# EAGLE schematic EEZ Arduino shield r1B12b (EAGLE 6.1)
Assembly variants: Farnell, TME

## Sheet 1 of 3
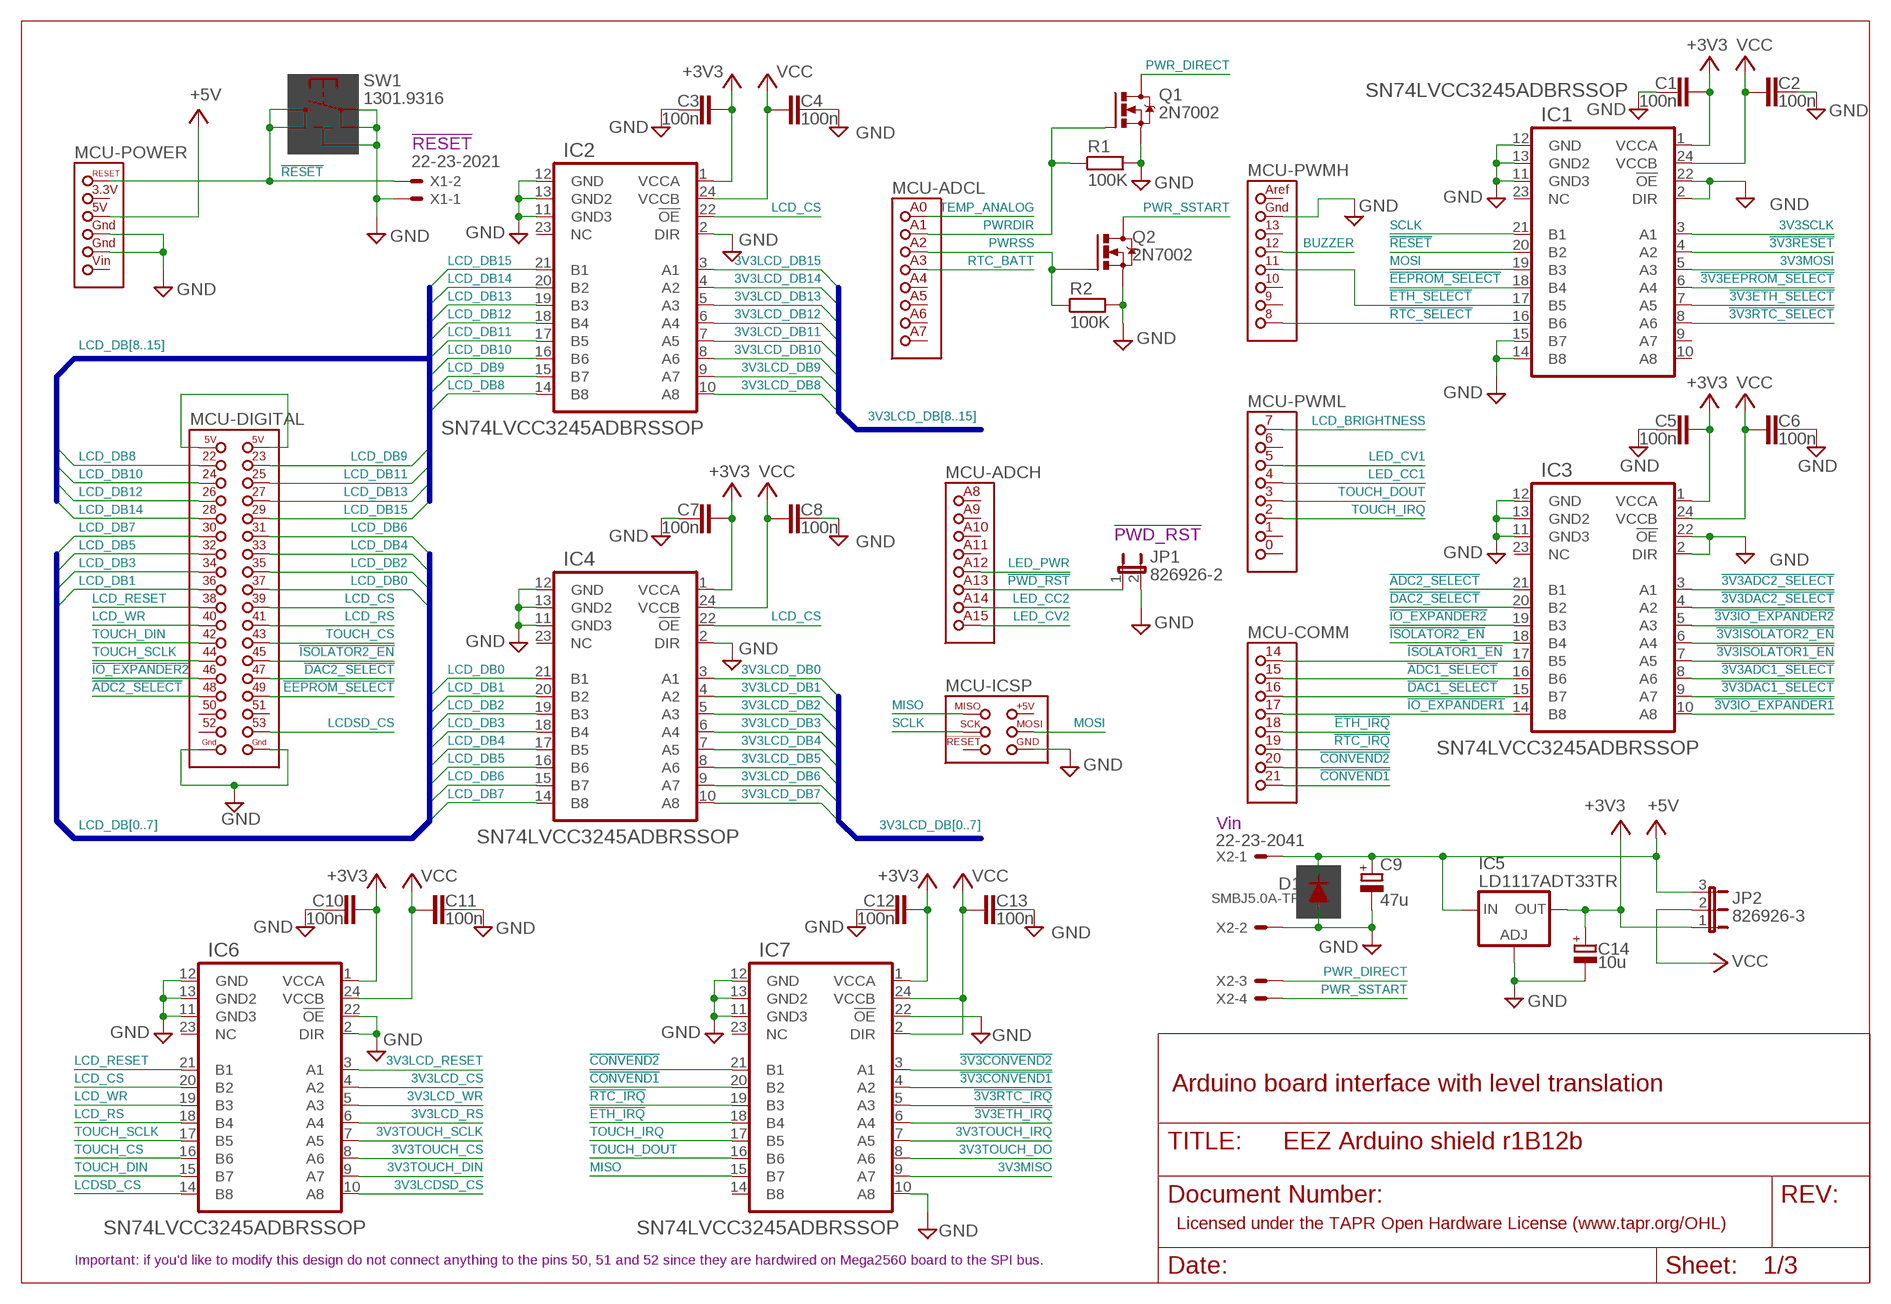
[diagram p0: schematic, sheet 1]

### Parts
C1  100n  C-EUC0603  [C0603]
C2  100n  C-EUC0603  [C0603]
C3  100n  C-EUC0603  [C0603]
C4  100n  C-EUC0603  [C0603]
C5  100n  C-EUC0603  [C0603]
C6  100n  C-EUC0603  [C0603]
C7  100n  C-EUC0603  [C0603]
C8  100n  C-EUC0603  [C0603]
C9  47u  ECAPPANASONIC_C  [PANASONIC_C]
C10  100n  C-EUC0603  [C0603]
C11  100n  C-EUC0603  [C0603]
C12  100n  C-EUC0603  [C0603]
C13  100n  C-EUC0603  [C0603]
C14  10u  ECAPPANASONIC_C  [PANASONIC_C]
D1  SMBJ5.0A-TR  DIODEDO214AA  [DO214AA]
IC1  SN74LVCC3245ADBRSSOP  [SOP65P780X200-24N]
IC2  SN74LVCC3245ADBRSSOP  [SOP65P780X200-24N]
IC3  SN74LVCC3245ADBRSSOP  [SOP65P780X200-24N]
IC4  SN74LVCC3245ADBRSSOP  [SOP65P780X200-24N]
IC5  LD1117ADT33TR  LD117ADT33TR  [DPACK]
IC6  SN74LVCC3245ADBRSSOP  [SOP65P780X200-24N]
IC7  SN74LVCC3245ADBRSSOP  [SOP65P780X200-24N]
JP1  826926-2  JP1E  [JP1]
JP2  826926-3  JUMPER_3-PIN  [JUMPER_3-PIN]
MCU  ARDUINO_MEGA+ICSPMIRROR  [ARDUINO+ICSP_MIRROR]
Q1  2N7002  [SOT103P240X110-3N]
Q2  2N7002  [SOT103P240X110-3N]
R1  100K  R-EU_R0805  [R0805]
R2  100K  R-EU_R0805  [R0805]
SW1  1301.9316  TACT_SW  [TACTM-6XN]
X1  22-23-2021  [22-23-2021]
X2  22-23-2041  [22-23-2041]

### Nets
3V3LCD_CS: IC6.4(A2) ; also sheet 3
3V3LCD_DB0: IC4.3(A1) ; also sheet 3
3V3LCD_DB1: IC4.4(A2) ; also sheet 3
3V3LCD_DB2: IC4.5(A3) ; also sheet 3
3V3LCD_DB3: IC4.6(A4) ; also sheet 3
3V3LCD_DB4: IC4.7(A5) ; also sheet 3
3V3LCD_DB5: IC4.8(A6) ; also sheet 3
3V3LCD_DB6: IC4.9(A7) ; also sheet 3
3V3LCD_DB7: IC4.10(A8) ; also sheet 3
3V3LCD_DB8: IC2.10(A8) ; also sheet 3
3V3LCD_DB9: IC2.9(A7) ; also sheet 3
3V3LCD_DB10: IC2.8(A6) ; also sheet 3
3V3LCD_DB11: IC2.7(A5) ; also sheet 3
3V3LCD_DB12: IC2.6(A4) ; also sheet 3
3V3LCD_DB13: IC2.5(A3) ; also sheet 3
3V3LCD_DB14: IC2.4(A2) ; also sheet 3
3V3LCD_DB15: IC2.3(A1) ; also sheet 3
3V3LCD_RESET: IC6.3(A1) ; also sheet 3
3V3LCD_RS: IC6.6(A4) ; also sheet 3
3V3LCD_WR: IC6.5(A3) ; also sheet 3
3V3LCDSD_CS: IC6.10(A8) ; also sheet 3
3V3MISO: IC7.9(A7) ; also sheet 2,3
3V3MOSI: IC1.5(A3) ; also sheet 2,3
3V3SCLK: IC1.3(A1) ; also sheet 2,3
3V3TOUCH_CS: IC6.8(A6) ; also sheet 3
3V3TOUCH_DIN: IC6.9(A7) ; also sheet 3
3V3TOUCH_DO: IC7.8(A6) ; also sheet 3
3V3TOUCH_IRQ: IC7.7(A5) ; also sheet 3
3V3TOUCH_SCLK: IC6.7(A5) ; also sheet 3
!3V3ADC1_SELECT: IC3.8(A6) ; also sheet 2
!3V3ADC2_SELECT: IC3.3(A1) ; also sheet 2
!3V3CONVEND1: IC7.4(A2) ; also sheet 2
!3V3CONVEND2: IC7.3(A1) ; also sheet 2
!3V3DAC1_SELECT: IC3.9(A7) ; also sheet 2
!3V3DAC2_SELECT: IC3.4(A2) ; also sheet 2
!3V3EEPROM_SELECT: IC1.6(A4) ; also sheet 3
!3V3ETH_IRQ: IC7.6(A4) ; also sheet 3
!3V3ETH_SELECT: IC1.7(A5) ; also sheet 3
!3V3IO_EXPANDER1: IC3.10(A8) ; also sheet 2
!3V3IO_EXPANDER2: IC3.5(A3) ; also sheet 2
!3V3ISOLATOR1_EN: IC3.7(A5) ; also sheet 2
!3V3ISOLATOR2_EN: IC3.6(A4) ; also sheet 2
!3V3RESET: IC1.4(A2) ; also sheet 2,3
!3V3RTC_IRQ: IC7.5(A3) ; also sheet 3
!3V3RTC_SELECT: IC1.8(A6) ; also sheet 3
!ADC1_SELECT: IC3.16(B6) MCU.15
!ADC2_SELECT: IC3.21(B1) MCU.48(-DIGITAL:48(PL3))
!CONVEND1: IC7.20(B2) MCU.21
!CONVEND2: IC7.21(B1) MCU.20
!DAC1_SELECT: IC3.15(B7) MCU.16
!DAC2_SELECT: IC3.20(B2) MCU.47(-DIGITAL:47(PL4))
!EEPROM_SELECT: IC1.18(B4) MCU.49(-DIGITAL:49(PL2))
!ETH_IRQ: IC7.18(B4) MCU.18
!ETH_SELECT: IC1.17(B5) MCU.11
!IO_EXPANDER1: IC3.14(B8) MCU.17
!IO_EXPANDER2: IC3.19(B3) MCU.46(-DIGITAL:46(PL5))
!ISOLATOR1_EN: IC3.17(B5) MCU.14
!ISOLATOR2_EN: IC3.18(B4) MCU.45(-DIGITAL:45(PL6))
!PWD_RST: JP1.1 MCU.A13(-ADCH:ADC13)
!RESET: IC1.20(B2) MCU.RESET(-POWER:!RESET) SW1.3 SW1.4 X1.2
!RTC_IRQ: IC7.19(B3) MCU.19
!RTC_SELECT: IC1.16(B6) MCU.8(-PWMH:8(PH5))
+3V3 [power]: C1.1 C3.1 C5.1 C7.1 C10.1 C12.1 C14.1(+) IC1.1(VCCA) IC2.1(VCCA) IC3.1(VCCA) IC4.1(VCCA) IC5.4(OUT) IC6.1(VCCA) IC7.1(VCCA) JP2.1 ; also sheet 2,3
+5V: C9.1(+) D1.C IC5.3(IN) JP2.3 MCU.5V(-POWER:5V) X2.1 ; also sheet 2,3
BUZZER: MCU.12 ; also sheet 3
GND [gnd]: C1.2 C2.1 C3.2 C4.1 C5.2 C6.1 C7.2 C8.1 C9.2(-) C10.2 C11.1 C12.2 C13.1 C14.2(-) D1.A IC1.2(DIR) IC1.11(GND3) IC1.12(GND) IC1.13(GND2) IC1.14(B8) IC1.15(B7) IC1.22(!OE) IC2.2(DIR) IC2.11(GND3) IC2.12(GND) IC2.13(GND2) IC3.2(DIR) IC3.11(GND3) IC3.12(GND) IC3.13(GND2) IC3.22(!OE) IC4.2(DIR) IC4.11(GND3) IC4.12(GND) IC4.13(GND2) IC5.1(ADJ) IC6.2(DIR) IC6.11(GND3) IC6.12(GND) IC6.13(GND2) IC6.22(!OE) IC7.10(A8) IC7.11(GND3) IC7.12(GND) IC7.13(GND2) IC7.22(!OE) JP1.2 MCU.GND1(-POWER:GND1) MCU.GND2(-POWER:GND2) MCU.GND3(-DIGITAL:GND3) MCU.GND4(-DIGITAL:GND4) MCU.GND(-PWMH:GND) MCU.ICSP_GND(-ICSP:GND) Q1.2(S) Q2.2(S) R1.2 R2.2 SW1.1 SW1.2 SW1.5(5-GND) X1.1 X2.2 ; also sheet 2,3
LCD_BRIGHTNESS: MCU.7(-PWML:7(PH4)) ; also sheet 3
LCD_CS: IC2.22(!OE) IC4.22(!OE) IC6.20(B2) MCU.39(-DIGITAL:39(PC0))
LCD_DB0: IC4.21(B1) MCU.37(-DIGITAL:37(PC2))
LCD_DB1: IC4.20(B2) MCU.36(-DIGITAL:36(PC3))
LCD_DB2: IC4.19(B3) MCU.35(-DIGITAL:35(PC4))
LCD_DB3: IC4.18(B4) MCU.34(-DIGITAL:34(PC5))
LCD_DB4: IC4.17(B5) MCU.33(-DIGITAL:33(PC6))
LCD_DB5: IC4.16(B6) MCU.32(-DIGITAL:32(PC7))
LCD_DB6: IC4.15(B7) MCU.31(-DIGITAL:31(PA7))
LCD_DB7: IC4.14(B8) MCU.30(-DIGITAL:30(PA6))
LCD_DB8: IC2.14(B8) MCU.22
LCD_DB9: IC2.15(B7) MCU.23
LCD_DB10: IC2.16(B6) MCU.24(-DIGITAL:24(PA0))
LCD_DB11: IC2.17(B5) MCU.25(-DIGITAL:25(PA1))
LCD_DB12: IC2.18(B4) MCU.26(-DIGITAL:26(PA2))
LCD_DB13: IC2.19(B3) MCU.27(-DIGITAL:27(PA3))
LCD_DB14: IC2.20(B2) MCU.28(-DIGITAL:28(PA4))
LCD_DB15: IC2.21(B1) MCU.29(-DIGITAL:29(PA5))
LCD_RESET: IC6.21(B1) MCU.38(-DIGITAL:38(PC1))
LCD_RS: IC6.18(B4) MCU.41(-DIGITAL:41(PG2))
LCD_WR: IC6.19(B3) MCU.40(-DIGITAL:40(PD7))
LCDSD_CS: IC6.14(B8) MCU.53(-DIGITAL:53(PB2/MOSI))
LED_CC1: MCU.4(-PWML:4(PG5)) ; also sheet 2
LED_CC2: MCU.A14(-ADCH:ADC14) ; also sheet 2
LED_CV1: MCU.5(-PWML:5(PE3)) ; also sheet 2
LED_CV2: MCU.A15(-ADCH:ADC15) ; also sheet 2
LED_PWR: MCU.A12(-ADCH:ADC12) ; also sheet 2
MISO: IC7.15(B7) MCU.ICSP_MISO(-ICSP:MISO)
MOSI: IC1.19(B3) MCU.ICSP_MOSI(-ICSP:MOSI)
N$20: MCU.5V(1)(-DIGITAL:5V(1)) MCU.5V(2)(-DIGITAL:5V(2))
PWR_DIRECT: Q1.3(D) X2.3
PWR_SSTART: Q2.3(D) X2.4
PWRDIR: MCU.A1(-ADCL:ADC1) Q1.1(G) R1.1
PWRSS: MCU.A2(-ADCL:ADC2) Q2.1(G) R2.1
RTC_BATT: MCU.A3(-ADCL:ADC3) ; also sheet 3
SCLK: IC1.21(B1) MCU.ICSP_SCK(-ICSP:SCK)
TEMP_ANALOG: MCU.A0(-ADCL:ADC0) ; also sheet 3
TOUCH_CS: IC6.16(B6) MCU.43(-DIGITAL:43(PG0))
TOUCH_DIN: IC6.15(B7) MCU.42(-DIGITAL:42(PG1))
TOUCH_DOUT: IC7.16(B6) MCU.3(-PWML:3(PE5))
TOUCH_IRQ: IC7.17(B5) MCU.2(-PWML:2(PE4))
TOUCH_SCLK: IC6.17(B5) MCU.44(-DIGITAL:44(PL7))
VCC [power]: C2.2 C4.2 C6.2 C8.2 C11.2 C13.2 IC1.24(VCCB) IC2.24(VCCB) IC3.24(VCCB) IC4.24(VCCB) IC6.24(VCCB) IC7.2(DIR) IC7.24(VCCB) JP2.2 ; also sheet 3
Unconnected: IC1.9(A7) IC1.10(A8) IC1.23(NC) IC2.23(NC) IC3.23(NC) IC4.23(NC) IC6.23(NC) IC7.14(B8) IC7.23(NC) MCU.0(-PWML:0(PE0)) MCU.1(-PWML:1(PE1)) MCU.3.3V(-POWER:3V3) MCU.6(-PWML:6(PH3)) MCU.9(-PWMH:9(PH6)) MCU.10 MCU.13 MCU.50(-DIGITAL:50(PL1/MISO)) MCU.51(-DIGITAL:51(PL0)) MCU.52(-DIGITAL:52(PB3/SCK)) MCU.A4(-ADCL:ADC4) MCU.A5(-ADCL:ADC5) MCU.A6(-ADCL:ADC6) MCU.A7(-ADCL:ADC7) MCU.A8(-ADCH:ADC8) MCU.A9(-ADCH:ADC9) MCU.A10(-ADCH:ADC10) MCU.A11(-ADCH:ADC11) MCU.AREF(-PWMH:AREF) MCU.ICSP_+5V(-ICSP:+5V) MCU.ICSP_RESET(-ICSP:!RESET) MCU.VIN(-POWER:VIN)

### Buses
LCD_DB[8..15]
LCD_DB[0..7]
3V3LCD_DB[8..15]
3V3LCD_DB[0..7]

### Notes on the sheet
- !RESET
- !PWD_RST
- Vin
- Arduino board interface with level translation
- Licensed under the TAPR Open Hardware License (www.tapr.org/OHL)
- Important: if you'd like to modify this design do not connect anything to the pins 50, 51 and 52 since they are hardwired on Mega2560 board to the SPI bus.

## Sheet 2 of 3
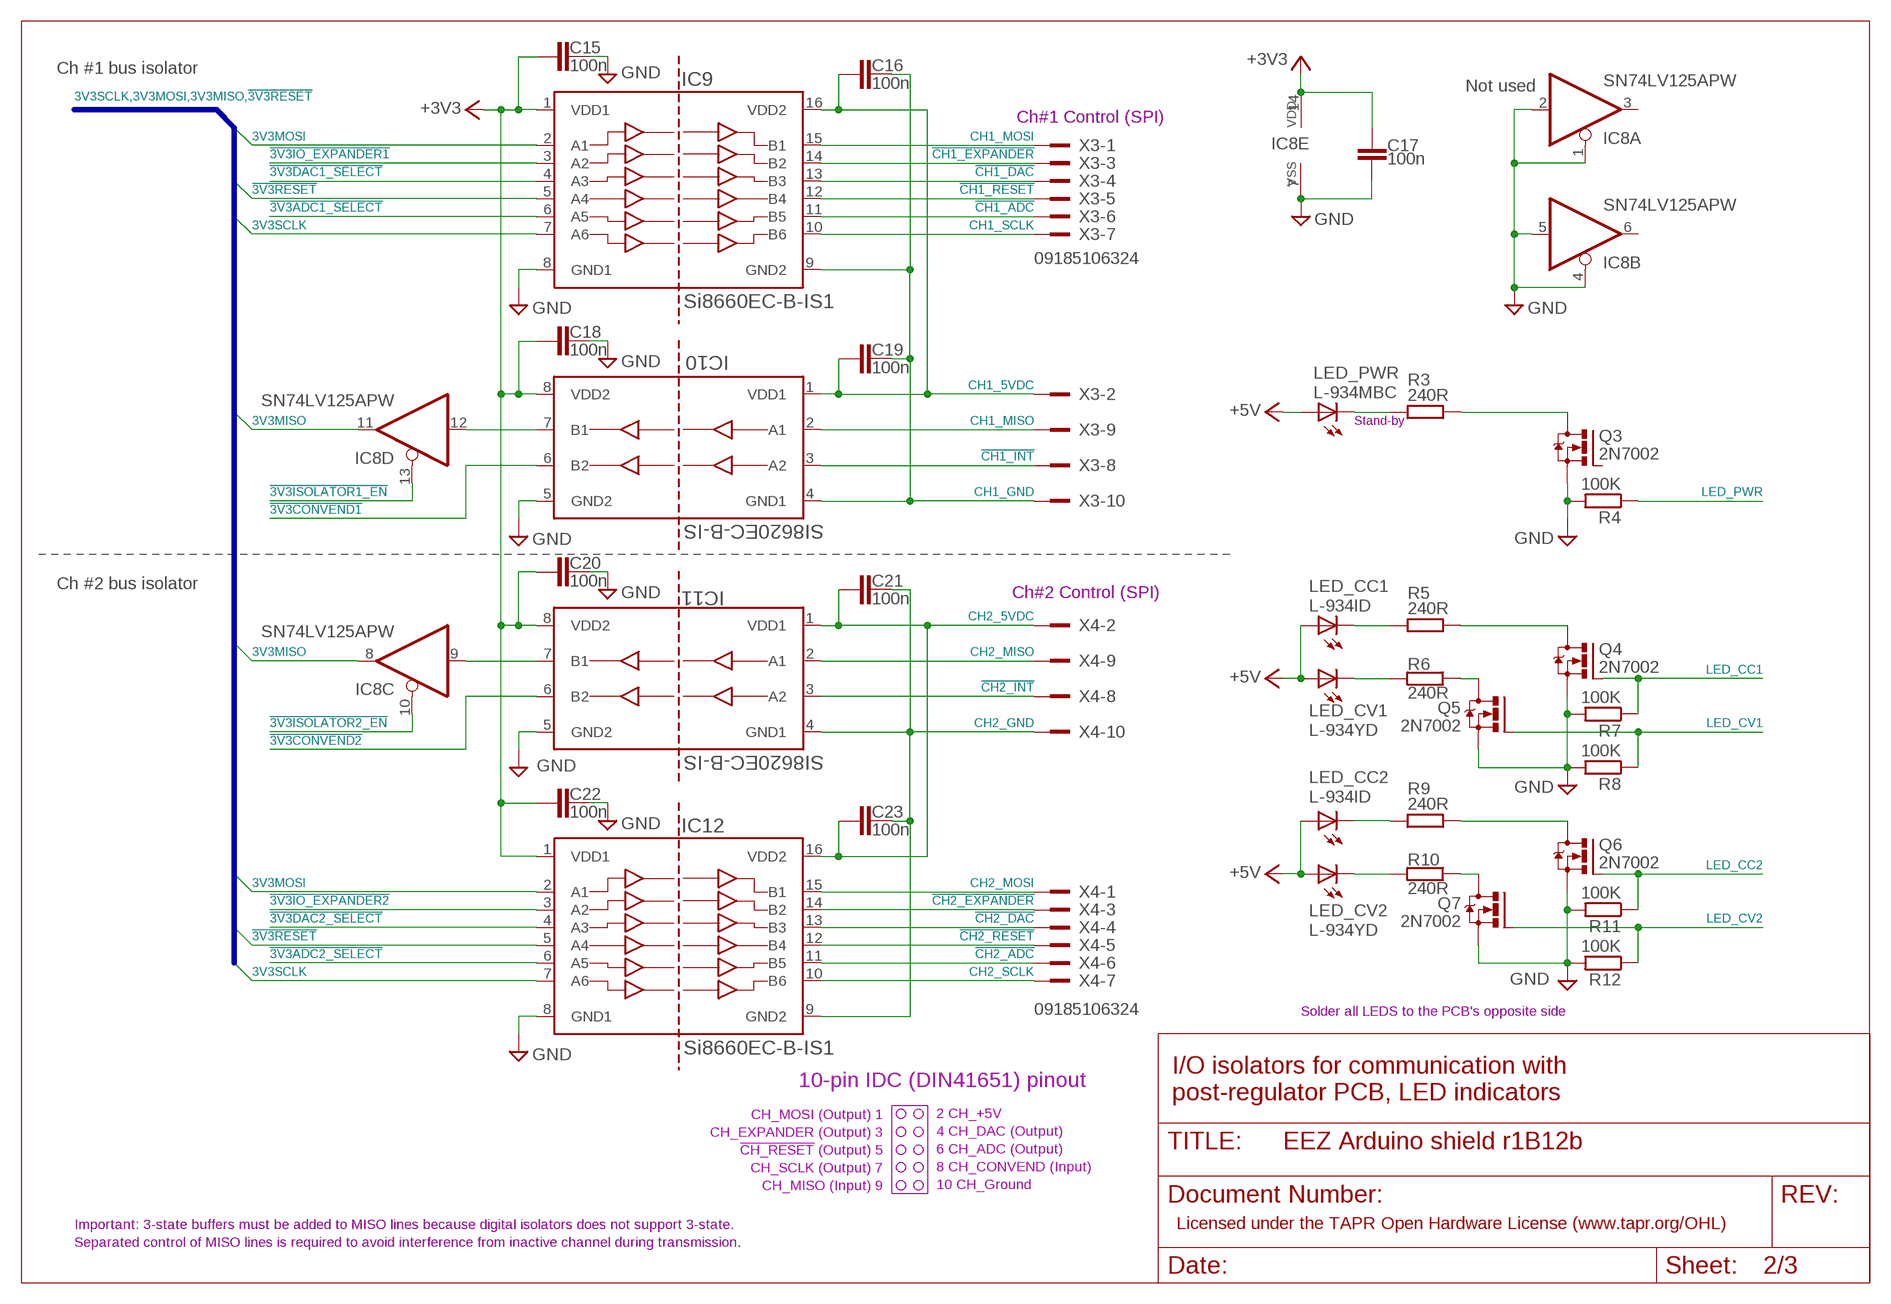
[diagram p1: schematic, sheet 2]

### Parts
C15  100n  C-EUC0603  [C0603]
C16  100n  C-EUC0603  [C0603]
C17  100n  C-EUC0603  [C0603]
C18  100n  C-EUC0603  [C0603]
C19  100n  C-EUC0603  [C0603]
C20  100n  C-EUC0603  [C0603]
C21  100n  C-EUC0603  [C0603]
C22  100n  C-EUC0603  [C0603]
C23  100n  C-EUC0603  [C0603]
IC8  SN74LV125APW  SN74LV125ATSSOP14  [SOP65P640X120-14N]
IC9  Si8660EC-B-IS1  SI8660  [SOIC-16]
IC10  SI8620EC-B-IS  SI8620  [SOIC127P600X173-8N]
IC11  SI8620EC-B-IS  SI8620  [SOIC127P600X173-8N]
IC12  Si8660EC-B-IS1  SI8660  [SOIC-16]
LED_CC1  L-934ID  LED3MM  [LED3MM]
LED_CC2  L-934ID  LED3MM  [LED3MM]
LED_CV1  L-934YD  LED3MM  [LED3MM]
LED_CV2  L-934YD  LED3MM  [LED3MM]
LED_PWR  L-934MBC  LED3MM  [LED3MM]
Q3  2N7002  [SOT103P240X110-3N]
Q4  2N7002  [SOT103P240X110-3N]
Q5  2N7002  [SOT103P240X110-3N]
Q6  2N7002  [SOT103P240X110-3N]
Q7  2N7002  [SOT103P240X110-3N]
R3  240R  R-EU_R0805  [R0805]
R4  100K  R-EU_R0805  [R0805]
R5  240R  R-EU_R0805  [R0805]
R6  240R  R-EU_R0805  [R0805]
R7  100K  R-EU_R0805  [R0805]
R8  100K  R-EU_R0805  [R0805]
R9  240R  R-EU_R0805  [R0805]
R10  240R  R-EU_R0805  [R0805]
R11  100K  R-EU_R0805  [R0805]
R12  100K  R-EU_R0805  [R0805]
X3  09185106324  IDC-10PINGREY  [IDC-10PIN]
X4  09185106324  IDC-10PINGREY  [IDC-10PIN]

### Nets
3V3MISO: IC8.8(C:O) IC8.11(D:O) ; also sheet 1,3
3V3MOSI: IC9.2(A1) IC12.2(A1) ; also sheet 1,3
3V3SCLK: IC9.7(A6) IC12.7(A6) ; also sheet 1,3
!3V3ADC1_SELECT: IC9.6(A5) ; also sheet 1
!3V3ADC2_SELECT: IC12.6(A5) ; also sheet 1
!3V3CONVEND1: IC10.6(B2) ; also sheet 1
!3V3CONVEND2: IC11.6(B2) ; also sheet 1
!3V3DAC1_SELECT: IC9.4(A3) ; also sheet 1
!3V3DAC2_SELECT: IC12.4(A3) ; also sheet 1
!3V3IO_EXPANDER1: IC9.3(A2) ; also sheet 1
!3V3IO_EXPANDER2: IC12.3(A2) ; also sheet 1
!3V3ISOLATOR1_EN: IC8.13(D:OE) ; also sheet 1
!3V3ISOLATOR2_EN: IC8.10(C:OE) ; also sheet 1
!3V3RESET: IC9.5(A4) IC12.5(A4) ; also sheet 1,3
!CH1_ADC: IC9.11(B5) X3.6
!CH1_DAC: IC9.13(B3) X3.4
!CH1_EXPANDER: IC9.14(B2) X3.3
!CH1_INT: IC10.3(A2) X3.8
!CH1_RESET: IC9.12(B4) X3.5
!CH2_ADC: IC12.11(B5) X4.6
!CH2_DAC: IC12.13(B3) X4.4
!CH2_EXPANDER: IC12.14(B2) X4.3
!CH2_INT: IC11.3(A2) X4.8
!CH2_RESET: IC12.12(B4) X4.5
+3V3 [power]: C15.1 C17.2 C18.1 C20.1 C22.1 IC8.14(E:VDD) IC9.1(VDD1) IC10.8(VDD2) IC11.8(VDD2) IC12.1(VDD1) ; also sheet 1,3
+5V: LED_CC1.A LED_CC2.A LED_CV1.A LED_CV2.A LED_PWR.A ; also sheet 1,3
CH1_5VDC: C16.1 C19.1 IC9.16(VDD2) IC10.1(VDD1) X3.2
CH1_GND [isolators]: C16.2 C19.2 IC9.9(GND2) IC10.4(GND1) X3.10
CH1_MISO: IC10.2(A1) X3.9
CH1_MOSI: IC9.15(B1) X3.1
CH1_SCLK: IC9.10(B6) X3.7
CH2_5VDC: C21.1 C23.1 IC11.1(VDD1) IC12.16(VDD2) X4.2
CH2_GND: C21.2 C23.2 IC11.4(GND1) IC12.9(GND2) X4.10
CH2_MISO: IC11.2(A1) X4.9
CH2_MOSI: IC12.15(B1) X4.1
CH2_SCLK: IC12.10(B6) X4.7
GND [gnd]: C15.2 C17.1 C18.2 C20.2 C22.2 IC8.1(A:OE) IC8.2(A:I) IC8.4(B:OE) IC8.5(B:I) IC8.7(E:VSS) IC9.8(GND1) IC10.5(GND2) IC11.5(GND2) IC12.8(GND1) Q3.2(S) Q4.2(S) Q5.2(S) Q6.2(S) Q7.2(S) R4.2 R7.2 R8.2 R11.2 R12.2 ; also sheet 1,3
LED_CC1: Q4.1(G) R7.1 ; also sheet 1
LED_CC2: Q6.1(G) R11.1 ; also sheet 1
LED_CV1: Q5.1(G) R8.1 ; also sheet 1
LED_CV2: Q7.1(G) R12.1 ; also sheet 1
LED_PWR: R4.1 ; also sheet 1
N$2: Q3.3(D) R3.2
N$4: LED_PWR.K(C) R3.1
N$11: LED_CV1.K(C) R6.2
N$12: Q6.3(D) R9.2
N$14: LED_CV2.K(C) R10.2
N$15: LED_CC2.K(C) R9.1
N$21: Q4.3(D) R5.2
N$23: Q7.3(D) R10.1
N$28: Q5.3(D) R6.1
N$29: LED_CC1.K(C) R5.1
N$151: IC8.12(D:I) IC10.7(B1)
N$164: IC8.9(C:I) IC11.7(B1)
Unconnected: IC8.3(A:O) IC8.6(B:O) Q3.1(G)

### Buses
3V3SCLK,3V3MOSI,3V3MISO,!3V3RESET

### Notes on the sheet
- Ch #1 bus isolator
- Not used
- Ch#1 Control (SPI)
- Stand-by
- Ch #2 bus isolator
- Ch#2 Control (SPI)
- Solder all LEDS to the PCB's opposite side
- I/O isolators for communication with
- 10-pin IDC (DIN41651) pinout
- post-regulator PCB, LED indicators
- CH_MOSI (Output) 1
- 2 CH_+5V
- CH_EXPANDER (Output) 3
- 4 CH_DAC (Output)
- !CH_RESET! (Output) 5
- 6 CH_ADC (Output)
- CH_SCLK (Output) 7
- 8 CH_CONVEND (Input)
- CH_MISO (Input) 9
- 10 CH_Ground
- Important: 3-state buffers must be added to MISO lines because digital isolators does not support 3-state. | Licensed under the TAPR Open Hardware License (www.tapr.org/OHL)
- Separated control of MISO lines is required to avoid interference from inactive channel during transmission.

## Sheet 3 of 3
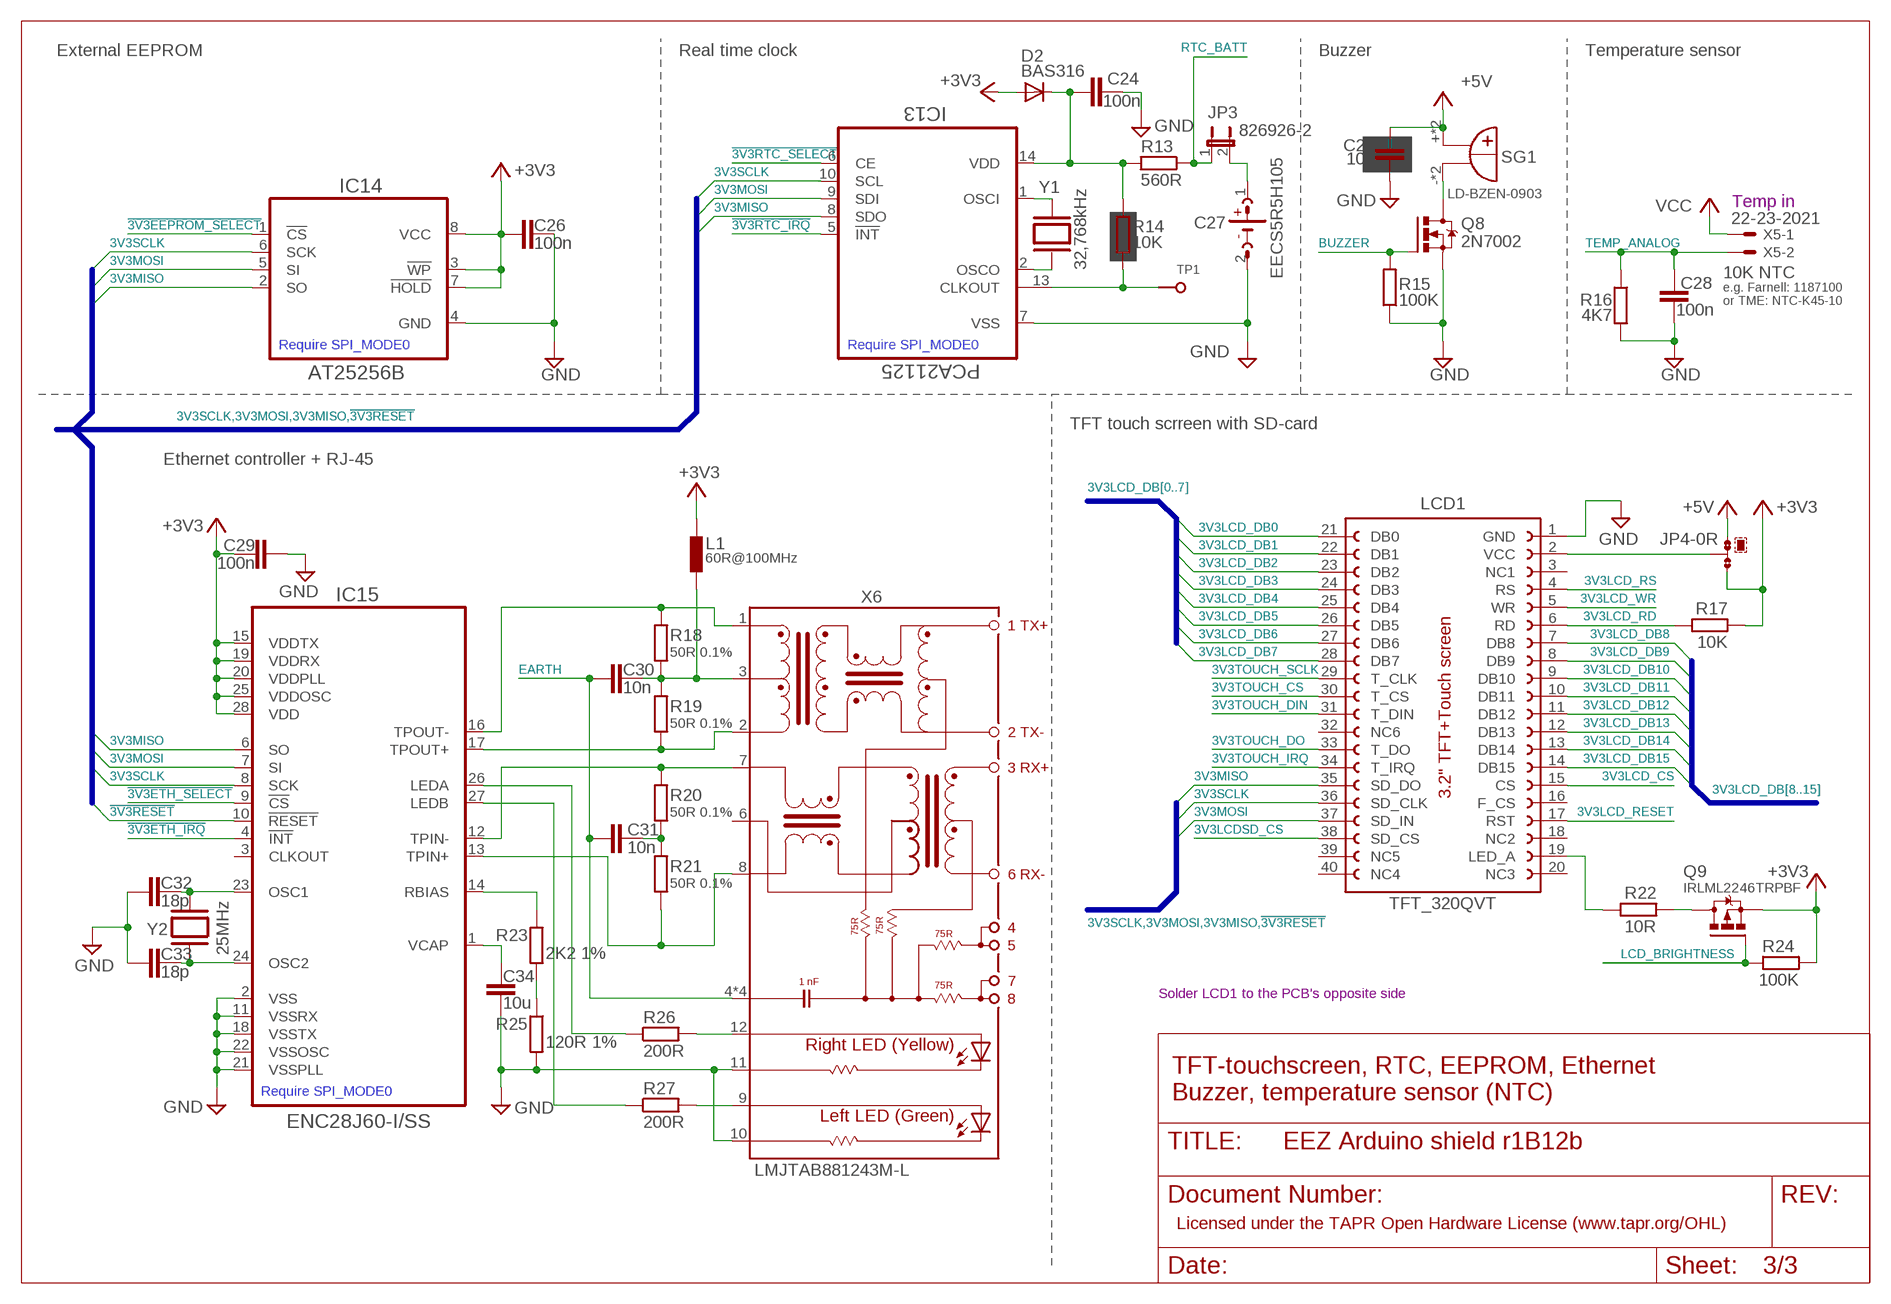
[diagram p2: schematic, sheet 3]

### Parts
C24  100n  C-EUC0603  [C0603]
C25  10u  C-EUC1206  [C1206]
C26  100n  C-EUC0603  [C0603]
C27  EECS5R5H105  SUPER_CAP  [SG-R20MM]
C28  100n  C-EUC0603  [C0603]
C29  100n  C-EUC0603  [C0603]
C30  10n  C-EUC1206  [C1206]
C31  10n  C-EUC1206  [C1206]
C32  18p  C-EUC0805  [C0805]
C33  18p  C-EUC0805  [C0805]
C34  10u  C-EUC1206  [C1206]
D2  BAS316  DIODE-SOD323-W  [SOD323-W]
IC13  PCA21125  PCA21125TSSOP-14  [SOP65P640X120-14N]
IC14  AT25256B  AT25XXXSOIC8  [SOIC127P600X175-8N]
IC15  ENC28J60-I/SS  [SOP65P780X200-28N]
JP3  826926-2  JP1E  [JP1]
JP4  0R-JUMPA  [A0R-JMP]
L1  60R@100MHz  FERRITE_BEAD0603  [BEAD0603]
LCD1  TFT_320QVT  LCD_TFT_320QVTMIRROR  [LCD_TFT_320QVT_MIRROR]
Q8  2N7002  [SOT103P240X110-3N]
Q9  IRLML2246TRPBF  [SOT95P237X112-3N]
R13  560R  R-EU_R0805  [R0805]
R14  10K  R-EU_R0805  [R0805]
R15  100K  R-EU_R0805  [R0805]
R16  4K7  R-EU_R0805  [R0805]
R17  10K  R-EU_R0805  [R0805]
R18  50R 0.1%  R-EU_R0805  [R0805]
R19  50R 0.1%  R-EU_R0805  [R0805]
R20  50R 0.1%  R-EU_R0805  [R0805]
R21  50R 0.1%  R-EU_R0805  [R0805]
R22  10R  R-EU_R0805  [R0805]
R23  2K2 1%  R-EU_R0805  [R0805]
R24  100K  R-EU_R0805  [R0805]
R25  120R 1%  R-EU_R0805  [R0805]
R26  200R  R-EU_R0805  [R0805]
R27  200R  R-EU_R0805  [R0805]
SG1  LD-BZEN-0903  BUZZER  [BUZZER]
TP1  PCB_TEST_TABSHIELD  [PCB_SHIELD_TAB]
X5  22-23-2021  [22-23-2021]
X6  LMJTAB881243M-L  RJ45-TRAFO-LED  [RJ45-TRAFO-LED]
Y1  32,768kHz  XTALR26  [R26_XTAL]
Y2  25MHz  XTALSMD  [HC-49/4H]

### Nets
3V3LCD_CS: LCD1.15(CS) ; also sheet 1
3V3LCD_DB0: LCD1.21(DB0) ; also sheet 1
3V3LCD_DB1: LCD1.22(DB1) ; also sheet 1
3V3LCD_DB2: LCD1.23(DB2) ; also sheet 1
3V3LCD_DB3: LCD1.24(DB3) ; also sheet 1
3V3LCD_DB4: LCD1.25(DB4) ; also sheet 1
3V3LCD_DB5: LCD1.26(DB5) ; also sheet 1
3V3LCD_DB6: LCD1.27(DB6) ; also sheet 1
3V3LCD_DB7: LCD1.28(DB7) ; also sheet 1
3V3LCD_DB8: LCD1.7(DB8) ; also sheet 1
3V3LCD_DB9: LCD1.8(DB9) ; also sheet 1
3V3LCD_DB10: LCD1.9(DB10) ; also sheet 1
3V3LCD_DB11: LCD1.10(DB11) ; also sheet 1
3V3LCD_DB12: LCD1.11(DB12) ; also sheet 1
3V3LCD_DB13: LCD1.12(DB13) ; also sheet 1
3V3LCD_DB14: LCD1.13(DB14) ; also sheet 1
3V3LCD_DB15: LCD1.14(DB15) ; also sheet 1
3V3LCD_RD: LCD1.6(RD) R17.1
3V3LCD_RESET: LCD1.17(RST) ; also sheet 1
3V3LCD_RS: LCD1.4(RS) ; also sheet 1
3V3LCD_WR: LCD1.5(WR) ; also sheet 1
3V3LCDSD_CS: LCD1.38(SD_CS) ; also sheet 1
3V3MISO: IC13.8(SDO) IC14.2(SO) IC15.6(SO) LCD1.35(SD_DO) ; also sheet 1,2
3V3MOSI: IC13.9(SDI) IC14.5(SI) IC15.7(SI) LCD1.37(SD_IN) ; also sheet 1,2
3V3SCLK: IC13.10(SCL) IC14.6(SCK) IC15.8(SCK) LCD1.36(SD_CLK) ; also sheet 1,2
3V3TOUCH_CS: LCD1.30(T_CS) ; also sheet 1
3V3TOUCH_DIN: LCD1.31(T_DIN) ; also sheet 1
3V3TOUCH_DO: LCD1.33(T_DO) ; also sheet 1
3V3TOUCH_IRQ: LCD1.34(T_IRQ) ; also sheet 1
3V3TOUCH_SCLK: LCD1.29(T_CLK) ; also sheet 1
!3V3EEPROM_SELECT: IC14.1(!CS) ; also sheet 1
!3V3ETH_IRQ: IC15.4(!INT) ; also sheet 1
!3V3ETH_SELECT: IC15.9(!CS) ; also sheet 1
!3V3RESET: IC15.10(!RESET) ; also sheet 1,2
!3V3RTC_IRQ: IC13.5(!INT) ; also sheet 1
!3V3RTC_SELECT: IC13.6(CE) ; also sheet 1
+3V3 [power]: C26.1 C29.1 D2.A IC14.3(!WP) IC14.7(!HOLD) IC14.8(VCC) IC15.15(VDDTX) IC15.19(VDDRX) IC15.20(VDDPLL) IC15.25(VDDOSC) IC15.28(VDD) JP4.3 L1.P$2 Q9.2(S) R17.2 R24.2 ; also sheet 1,2
+5V: C25.2 JP4.1 SG1.+ SG1.+B(+) ; also sheet 1,2
BUZZER: Q8.1(G) R15.2 ; also sheet 1
EARTH: C30.2 C31.2 X6.4(SH) X6.5(SH) X6.SH1(SH) X6.SH2(SH)
ETH_IN+: IC15.13(TPIN+) R21.1 X6.8(RD-)
ETH_IN-: IC15.12(TPIN-) R20.2 X6.7(RD+)
ETH_LEDA: IC15.26(LEDA) R26.1
ETH_LEDB: IC15.27(LEDB) R27.1
ETH_OUT+: IC15.17(TPOUT+) R19.1 X6.2(TD-)
ETH_OUT-: IC15.16(TPOUT-) R18.2 X6.1(TD+)
GND [gnd]: C24.1 C25.1 C26.2 C27.2(-) C28.1 C29.2 C32.2 C33.2 C34.1 IC13.7(VSS) IC14.4(GND) IC15.2(VSS) IC15.11(VSSRX) IC15.18(VSSTX) IC15.21(VSSPLL) IC15.22(VSSOSC) LCD1.1(GND) Q8.2(S) R15.1 R16.2 R25.2 X6.10(GREEN-C) X6.11(YELLOW-C) ; also sheet 1,2
LCD_BRIGHTNESS: Q9.1(G) R24.1 ; also sheet 1
LED_A: LCD1.19(LED_A) R22.2
N$10 [power]: JP4.2 LCD1.2(VCC)
N$13: Q9.3(D) R22.1
N$24: IC13.1(OSCI) Y1.2
N$25: IC13.2(OSCO) Y1.1
N$30: R23.2 R25.1
N$71: Q8.3(D) SG1.- SG1.-B(-)
N$83: IC13.13(CLKOUT) R14.2 TP1.1
N$84: C27.1(+) JP3.2
N$97: C32.1 IC15.23(OSC1) Y2.2
N$98: C33.1 IC15.24(OSC2) Y2.1
N$99: C34.2 IC15.1(VCAP)
N$101: IC15.14(RBIAS) R23.1
N$109: C24.2 D2.C IC13.14(VDD) R13.2 R14.1
N$115: R26.2 X6.12(YELLOW_A)
N$116: R27.2 X6.9(GREEN-A)
N$124: C31.1 R20.1 R21.2
N$125: C30.1 L1.P$1 R18.1 R19.2 X6.3(CT)
RTC_BATT: JP3.1 R13.1 ; also sheet 1
TEMP_ANALOG: C28.2 R16.1 X5.2 ; also sheet 1
VCC [power]: X5.1 ; also sheet 1
Unconnected: IC15.3(CLKOUT) LCD1.3(NC1) LCD1.16(F_CS) LCD1.18(NC2) LCD1.20(NC3) LCD1.32(NC6) LCD1.39(NC5) LCD1.40(NC4) X6.6(CR)

### Buses
3V3LCD_DB[8..15]
3V3LCD_DB[0..7]
3V3SCLK,3V3MOSI,3V3MISO,!3V3RESET

### Notes on the sheet
- External EEPROM | Real time clock | Buzzer | Temperature sensor
- Temp in
- 10K NTC
- e.g. Farnell: 1187100
- or TME: NTC-K45-10
- Require SPI_MODE0 | Require SPI_MODE0
- TFT touch scrreen with SD-card
- Ethernet controller + RJ-45
- Solder LCD1 to the PCB's opposite side
- TFT-touchscreen, RTC, EEPROM, Ethernet
- Require SPI_MODE0
- Buzzer, temperature sensor (NTC)
- Licensed under the TAPR Open Hardware License (www.tapr.org/OHL)

## Library data of the parts
C1-C8 C10-C13 C15-C26 C28-C34 = rcl:C-EU: CAPACITOR, European symbol
C9 C14 = MyLib6:ECAP
C27 = EEZ_Lib1:SUPER_CAP: Electric Double Layer Supercapacitors, Type EDL Vertical - Manufacturer Part No: EDLSG105V5R5C Farnell: 2113011 Horizontal - Manufacturer Part No: EDLSG105H5R5C Farnell: 1364209, 9697497
D1 = MyLib6:DIODE
D2 = diode:DIODE-: DIODE
IC1-IC4 IC6 IC7 = MyLib6:SN74LVCC3245ADBR: OCTAL BUS TRANSCEIVER WITH ADJUSTABLE OUTPUT VOLTAGE AND 3-STATE OUTPUTS; FARNELL: 2342537
IC5 = v-reg:LD117A?*: Low drop fixed and adjustable positive voltage regulators 1 A Source: http://www.st.com/stonline/products/literature/ds/7194/ld1117axx.pdf
IC8 = MyLib6:SN74LV125A: Quadruple Bus Buffer Gates With 3-State Outputs; FARNELL: 9592512; TME: SN74LV125APW
IC9 IC12 = MyLib6:SI8660: Low power 6-ch digital isolator (6+0); FARNELL: 2423356
IC10 IC11 = MyLib6:SI8620: Low power 2-ch digital isolator (2+0) Farnell: 2423240, 2423241
IC13 = MyLib6:PCA21125: SPI-bus Real-Time Clock and calendar Farnell: 2400445
IC14 = MyLib6:AT25XXX: SPI Serial EEPROM, Supports SPI Modes 0 (0,0) and 3 (1,1) Atmel AT25128 128K (16 384 x 8) Farnell: 2345601 Atmel AT25256 256K (32 768 x 8) Farnell: 1841577 Atmel AT25512 512K (65 536 x 8) Farnell: 2345608
IC15 = MyLib6:ENC28J60-I/SS: Stand-Alone Ethernet Controller; MPN: ENC28J60-I/SS; OC_FARNELL: 1084620; OC_NEWARK: 31K1708; PACKAGE: SOP-28; SUPPLIER: Microchip
JP1 JP3 = jumper:JP1E: JUMPER
JP2 = MyLib6:JUMPER_3-PIN
JP4 = jump-0r-smd:0R-JUMP: SMD 0R 0805 Jumper
L1 = MyLib6:FERRITE_BEAD: FAIR-RITE - 2506033007Y3 - FERRITE BEAD, 0.04OHM, 3A, 0603 Farnell: 2112873
LCD1 = MyLib6:LCD_TFT_320QVT: 3.2" 320x240 TFT Module Display Touch Panel with PCB 262K Colors IC SSD1289
LED_CC1 LED_CC2 LED_CV1 LED_CV2 LED_PWR = led:LED: LED OSRAM: - CHIPLED LG R971, LG N971, LY N971, LG Q971, LY Q971, LO R971, LY R971 LH N974, LH R974 LS Q976, LO Q976, LY Q976 LO Q996 - Hyper CHIPLED LW Q18S LB Q993, LB Q99A, LB R99A - SideLED LS A670, LO A670, LY A670, LG A670, LP A670 LB A673, LV A673, LT A673, LW A673 LH A674 LY A675 LS A676, LA A676, LO A676, LY A676, LW A676 LS A679, LY A679, LG A679 - Hyper Micro SIDELED® LS Y876, LA Y876, LO Y876, LY Y876 LT Y87S - SmartLED LW L88C, LW L88S LB L89C, LB L89S, LG L890 LS L89K, LO L89K, LY L89K LS L896, LA L896, LO L896, LY L896 - TOPLED LS T670, LO T670, LY T670, LG T670, LP T670 LSG T670, LSP T670, LSY T670, LOP T670, LYG T670 LG T671, LOG T671, LSG T671 LB T673, LV T673, LT T673, LW T673 LH T674 LS T676, LA T676, LO T676, LY T676, LB T676, LH T676, LSB T676, LW T676 LB T67C, LV T67C, LT T67C, LS T67K, LO T67K, LY T67K, LW E67C LS E67B, LA E67B, LO E67B, LY E67B, LB E67C, LV E67C, LT E67C LW T67C LS T679, LY T679, LG T679 LS T770, LO T770, LY T770, LG T770, LP T770 LB T773, LV T773, LT T773, LW T773 LH T774 LS E675, LA E675, LY E675, LS T675 LS T776, LA T776, LO T776, LY T776, LB T776 LHGB T686 LT T68C, LB T68C - Hyper Mini TOPLED® LB M676 - Mini TOPLED Santana® LG M470 LS M47K, LO M47K, LY M47K Source: http://www.osram.convergy.de LUXEON: - LUMILED® LXK2-PW12-R00, LXK2-PW12-S00, LXK2-PW14-U00, LXK2-PW14-V00 LXK2-PM12-R00, LXK2-PM12-S00, LXK2-PM14-U00 LXK2-PE12-Q00, LXK2-PE12-R00, LXK2-PE12-S00, LXK2-PE14-T00, LXK2-PE14-U00 LXK2-PB12-K00, LXK2-PB12-L00, LXK2-PB12-M00, LXK2-PB14-N00, LXK2-PB14-P00, LXK2-PB14-Q00 LXK2-PR12-L00, LXK2-PR12-M00, LXK2-PR14-Q00, LXK2-PR14-R00 LXK2-PD12-Q00, LXK2-PD12-R00, LXK2-PD12-S00 LXK2-PH12-R00, LXK2-PH12-S00 LXK2-PL12-P00, LXK2-PL12-Q00, LXK2-PL12-R00 Source: www.luxeon.com KINGBRIGHT: KA-3528ASYC Source: www.kingbright.com
MCU = EEZ_Lib1:ARDUINO_MEGA+ICSP
Q1-Q8 = MyLib6:2N7002: N-CHANNEL ENHANCEMENT MODE FIELD EFFECT TRANSISTOR; MPN: 2N7002-7-F; OC_FARNELL: 1713823; OC_NEWARK: 25R5679; PACKAGE: SOT-23-3; SUPPLIER: DIODES INC.
Q9 = MyLib6:IRLML2246TRPBF: HEXFET Power MOSFET (-20V, -2.6A); MPN: IRLML2246TRPBF; OC_FARNELL: 1888166; OC_NEWARK: 40T7450; PACKAGE: SOT-3; SUPPLIER: International Rectifier; TME: IRLML2246TRPBF
R1-R27 = rcl:R-EU_: RESISTOR, European symbol
SG1 = MyLib6:BUZZER
SW1 = MyLib6:TACT_SW
TP1 = MyLib6:PCB_TEST_TAB
X1 X5 = con-molex:22-23-2021: .100" (2.54mm) Center Header - 2 Pin; MF: MOLEX; MPN: 22-23-2021; OC_FARNELL: 1462926; OC_NEWARK: 25C3832
X2 = con-molex:22-23-2041: .100" (2.54mm) Center Header - 4 Pin; MF: MOLEX; MPN: 22-23-2041; OC_FARNELL: 1462920; OC_NEWARK: 38C0355
X3 X4 = MyLib6:IDC-10PIN: 10-pin IDC socket male, straight; TME: 09185106324
X6 = MyLib6:RJ45-TRAFO-LED: AMPHENOL LMJTAB881243M-L Socket; RJ45; PIN:8; shielded, with LED TME: LMJTAB881243M-L
Y1 Y2 = MyLib6:XTAL

## Net classes
0 default: width 0.254 mm, drill 0.61 mm, clearance 0.254 mm
1 power: width 0.254 mm, drill 0.406 mm, clearance 0.203 mm
2 gnd: width 0.254 mm, drill 0.406 mm, clearance 0.203 mm
3 isolators: width 0.254 mm, drill 0.61 mm, clearance 0.254 mm